# Altium schematic sheet RT v1.3_POWER.SchDoc
size A4
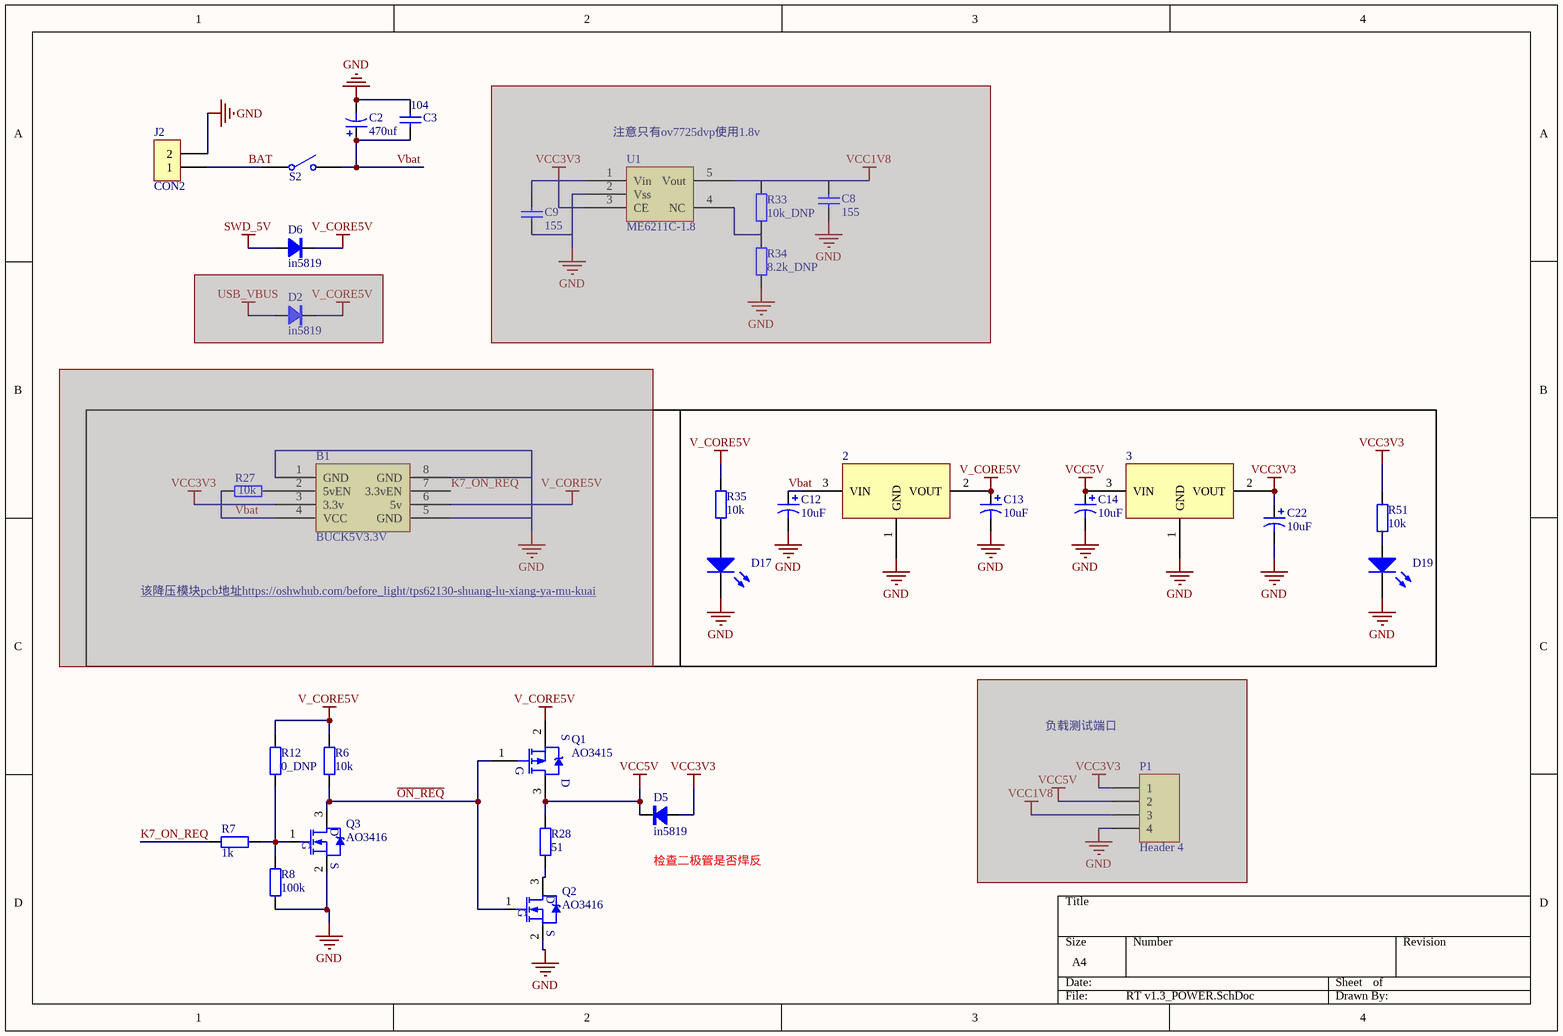
[diagram p0: RT v1.3_POWER.SchDoc]

## Parts
2  (no value)  [STO32]
3  (no value)  [STO32]
B1  BUCK5V3.3V  [BUCK5V3.3V_2]  (masked out: inside a compile mask, not in the netlist)
C2  value 470uf  [CAP 5.0*10*12.5 - BK]  (hidden comment: Cap Pol3)
C3  104  [CAPC_0603_1]
C8  value 155  [0603_CAP]  (hidden comment: 1.5uf)  (masked out: inside a compile mask, not in the netlist)
C9  value 155  [0603_CAP]  (hidden comment: 1.5uf)  (masked out: inside a compile mask, not in the netlist)
C12  value 10uF  [3216]  (hidden comment: Cap Pol3)
C13  value 10uF  [3216]  (hidden comment: Cap Pol3)
C14  value 10uF  [3216]  (hidden comment: Cap Pol3)
C22  value 10uF  [3216]  (hidden comment: Cap Pol3)
D2  in5819  [0805_Dio]  (masked out: inside a compile mask, not in the netlist)
D5  in5819  [0805_Dio]
D6  in5819  [0805_Dio]
D17  LED2  [LED_0603_B]  (value not drawn)
D19  LED2  [LED_0603_B]  (value not drawn)
J2  CON2  [XT30 Stand]
P1  Header 4  [HDR1X4]  (masked out: inside a compile mask, not in the netlist)
Q1  AO3415  [SOT95P245X110-3N]
Q2  AO3416  [SOT95P245X110-3N]
Q3  AO3416  [SOT95P245X110-3N]
R6  value 10k  [0603R]  (hidden comment: 470欧)
R7  value 1k  [0603R]  (hidden comment: 470欧)
R8  value 100k  [0603R]  (hidden comment: 470欧)
R12  value 0_DNP  [0603R]  (hidden comment: 470欧)
R27  value 10k  [0603R]  (hidden comment: 470欧)  (masked out: inside a compile mask, not in the netlist)
R28  value 51  [0603R]  (hidden comment: 470欧)
R33  value 10k_DNP  [0603R]  (hidden comment: 470欧)  (masked out: inside a compile mask, not in the netlist)
R34  value 8.2k_DNP  [0603R]  (hidden comment: 470欧)  (masked out: inside a compile mask, not in the netlist)
R35  value 10k  [0603R]  (hidden comment: 470欧)
R51  value 10k  [0603R]  (hidden comment: 470欧)
S2  总开关  [摇臂开关（小号）]  (value not drawn)
U1  ME6211C-1.8  [SOT23-5]  (masked out: inside a compile mask, not in the netlist)

## Nets
GND: 2.1(GND) 3.1(GND) C2.2 C3.2 C12.2 C13.2 C14.2 C22.2 D17.2(K) D19.2(K) J2.2 Q2.2(S) Q3.2(S) R8.1
SWD_5V: D6.1(A)
V_CORE5V: 2.2(VOUT) C13.1 D6.2(K) Q1.2(S) R6.2 R12.2 R35.2
VCC3V3: 3.2(VOUT) C22.1 D5.1(A) R51.2
VCC5V: 3.3(VIN) C14.1 D5.2(K) Q1.3(D) R28.2
BAT: J2.1 S2.1(COMMON)
K7_ON_REQ: R7.1
~{ON_REQ}: Q1.1(G) Q2.1(G) Q3.3(D) R6.1
Vbat: 2.3(VIN) C2.1 C3.1 C12.1 S2.2(NO)
NetD17_1: D17.1(A) R35.1
NetD19_1: D19.1(A) R51.1
NetQ2_3: Q2.3(D) R28.1
NetQ3_1: Q3.1(G) R7.2 R8.2 R12.1

## Notes on the sheet
- 注意只有ov7725dvp使用1.8v
- 该降压模块pcb地址https://oshwhub.com/before_light/tps62130-shuang-lu-xiang-ya-mu-kuai <https://oshwhub.com/before_light/tps62130-shuang-lu-xiang-ya-mu-kuai>
- 负载测试端口
- (near D5) 检查二极管是否焊反

## Library data of the parts
2 3 = AMS1117
C2 C12-C14 C22 = Cap Pol3: Polarized Capacitor (Surface Mount); Published: 8-Jun-2000; LatestRevisionDate: 17-Jul-2002; LatestRevisionNote: Re-released for DXP Platform.; PackageReference: C0805; Publisher: Altium Limited
C3 = Cap: Capacitor; Published: 8-Jun-2000; LatestRevisionDate: 17-Jul-2002; LatestRevisionNote: Re-released for DXP Platform.; PackageReference: RAD-0.3; Publisher: Altium Limited; Value: 104
C8 C9 = Cap_1: Capacitor; Published: 8-Jun-2000; LatestRevisionDate: 17-Jul-2002; LatestRevisionNote: Re-released for DXP Platform.; PackageReference: RAD-0.3; Publisher: Altium Limited; PackageDescription: Radial Cap, Thru-Hole; 2 Leads; 0.3 in Pin Spacing
D2 D5 D6 = DIO
D17 D19 = LED2_1: Typical RED, GREEN, YELLOW, AMBER GaAs LED; Published: 8-Jun-2000; LatestRevisionDate: 17-Jul-2002; LatestRevisionNote: Re-released for DXP Platform.; PackageDocument: Feb-2002; PackageReference: 3.2X1.6X1.1; Publisher: Altium Limited
J2 = CON2: Connector
P1 = Header 4: Header, 4-Pin; LatestRevisionDate: 17-Jul-2002; LatestRevisionNote: Re-released for DXP Platform.; Publisher: Altium Limited
Q1 = PMOS: N-Channel Power MOSFET; Note: Pin 2 is electrically connected to pin 4.; Published: 8-Jun-2000; LatestRevisionDate: 17-Jul-2002; LatestRevisionNote: Re-released for DXP Platform.; DatasheetVersion: PD-9.814; PackageVersion: Feb-1997; PackageReference: TO-220AB; Publisher: Altium Limited; PackageDescription: TO, Thru-Hole, Vertical, Heatsink Mounted; 3 In-Line Leads; Pitch 2.54 mm; ComponentLink1Description: Manufacturer Link; ComponentLink1URL: http://www.irf.com/; VALUE: AO3415
Q2 Q3 = NMOS: N-Channel Power MOSFET; Note: Pin 2 is electrically connected to pin 4.; Published: 8-Jun-2000; LatestRevisionDate: 17-Jul-2002; LatestRevisionNote: Re-released for DXP Platform.; DatasheetVersion: PD-9.814; PackageVersion: Feb-1997; PackageReference: TO-220AB; Publisher: Altium Limited; PackageDescription: TO, Thru-Hole, Vertical, Heatsink Mounted; 3 In-Line Leads; Pitch 2.54 mm; ComponentLink1Description: Manufacturer Link; ComponentLink1URL: http://www.irf.com/; VALUE: AO3416
R6-R8 R12 R27 R28 R33-R35 R51 = Res2_1: Resistor; Published: 8-Jun-2000; LatestRevisionDate: 17-Jul-2002; LatestRevisionNote: Re-released for DXP Platform.; PackageReference: AXIAL-0.4; Publisher: Altium Limited
S2 = SW-SPST: Single-Pole, Single-Throw Switch; Published: 24-Mar-1999; LatestRevisionDate: 17-Jul-2002; LatestRevisionNote: Re-released for DXP Platform.; PackageReference: SPST-2; Publisher: Altium Limited
U1 = ME6211Cxx